# EAGLE design Arduino_UART_SIDEWAYS (EAGLE 7.4.0)
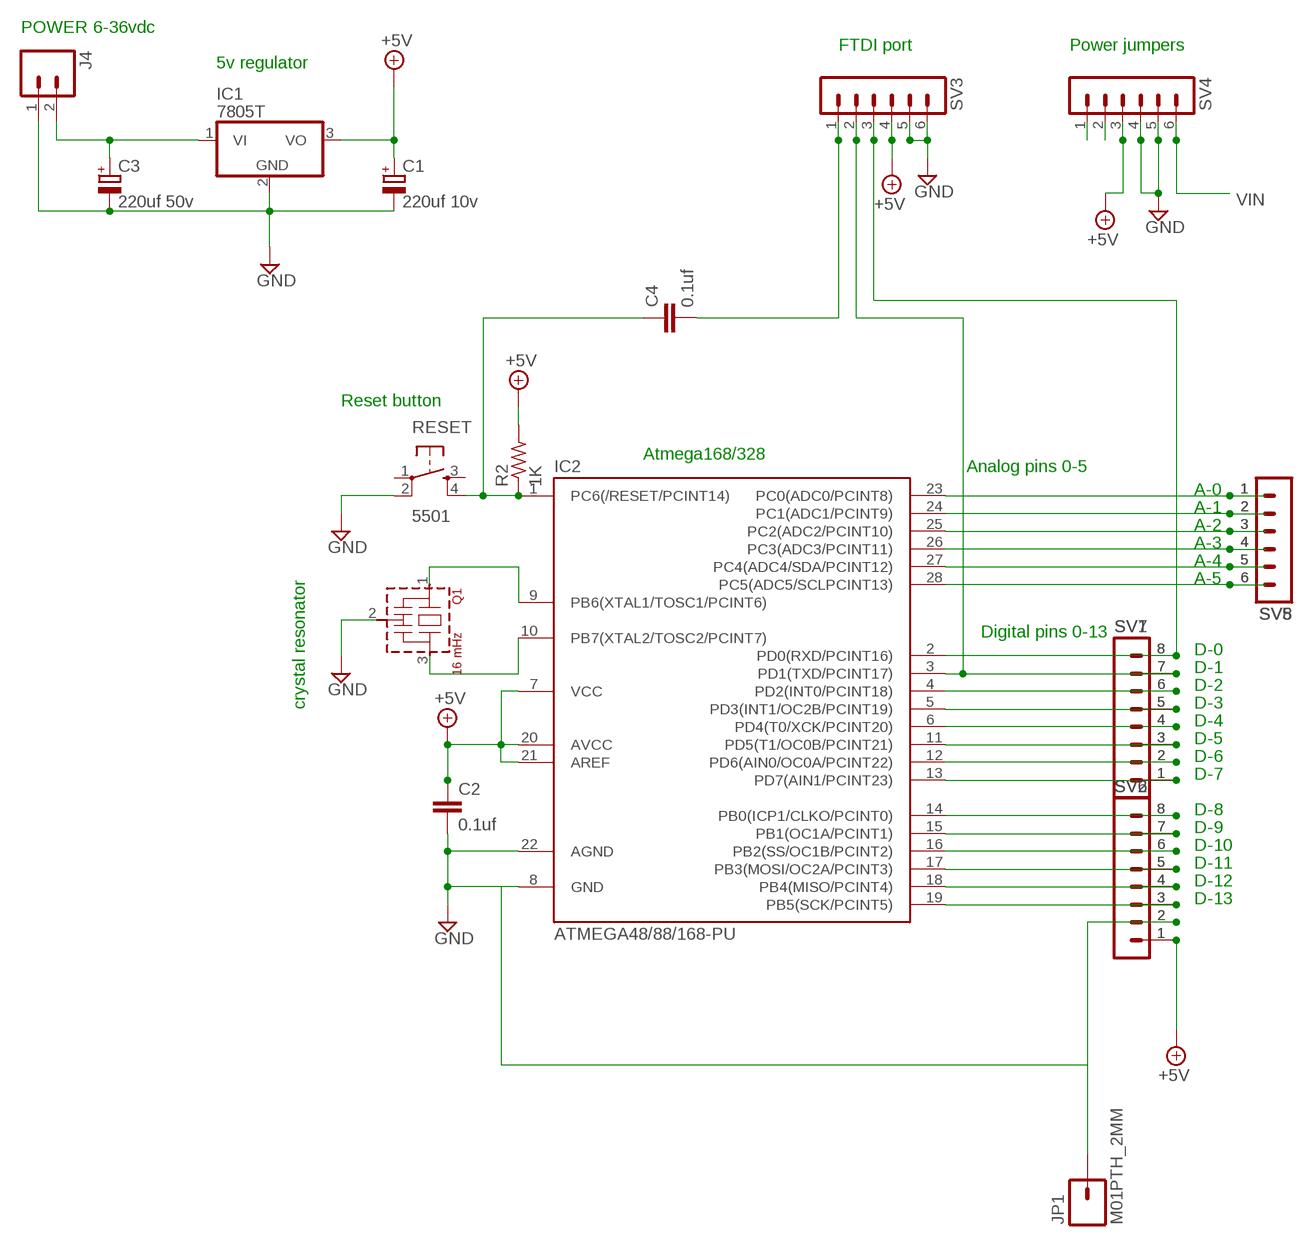
[diagram p0: schematic, sheet 1]

## Parts
C1  220uf 10v  CPOL-EUE2.5-6  [E2,5-6]
C2  0.1uf  C-EU050-024X044  [C050-024X044]
C3  220uf 50v  CPOL-EUE2.5-6  [E2,5-6]
C4  0.1uf  C-EU075-032X103  [C075-032X103]
IC1  7805T  [TO220H]
IC2  ATMEGA48/88/168-PU  [DIL28-3]
J4  M02LOCK  [1X02_LOCK]
JP1  M01PTH_2MM  [1X01_2MM]
Q1  16 mHz  CSTLS_X  [CSTLS_X]
R2  1K  R-US_0204/7  [0204/7]
RESET  5501  TAC_SWITCHPTH  [TACTILE-PTH]
SV1  MA08-1  [MA08-1]
SV2  MA08-1  [MA08-1]
SV3  MA06-1  [MA06-1]
SV4  MA06-1  [MA06-1]
SV5  MA06-1  [MA06-1]
SV6  MA08-1  [MA08-1]
SV7  MA08-1  [MA08-1]
SV8  MA06-1  [MA06-1]

## Nets
+5V: C1.+ C2.1 IC1.3(VO) IC2.7(VCC) IC2.20(AVCC) IC2.21(AREF) R2.2 SV2.1 SV3.4 SV4.3 SV6.1
A0: IC2.23(PC0(ADC0/PCINT8)) SV5.1 SV8.1
A1: IC2.24(PC1(ADC1/PCINT9)) SV5.2 SV8.2
A2: IC2.25(PC2(ADC2/PCINT10)) SV5.3 SV8.3
A3: IC2.26(PC3(ADC3/PCINT11)) SV5.4 SV8.4
A4: IC2.27(PC4(ADC4/SDA/PCINT12)) SV5.5 SV8.5
A5: IC2.28(PC5(ADC5/SCLPCINT13)) SV5.6 SV8.6
D0: IC2.2(PD0(RXD/PCINT16)) SV1.8 SV3.3 SV7.8
D1: IC2.3(PD1(TXD/PCINT17)) SV1.7 SV3.2 SV7.7
D2: IC2.4(PD2(INT0/PCINT18)) SV1.6 SV7.6
D3: IC2.5(PD3(INT1/OC2B/PCINT19)) SV1.5 SV7.5
D4: IC2.6(PD4(T0/XCK/PCINT20)) SV1.4 SV7.4
D5: IC2.11(PD5(T1/OC0B/PCINT21)) SV1.3 SV7.3
D6: IC2.12(PD6(AIN0/OC0A/PCINT22)) SV1.2 SV7.2
D7: IC2.13(PD7(AIN1/PCINT23)) SV1.1 SV7.1
D8: IC2.14(PB0(ICP1/CLKO/PCINT0)) SV2.8 SV6.8
D9: IC2.15(PB1(OC1A/PCINT1)) SV2.7 SV6.7
D10: IC2.16(PB2(SS/OC1B/PCINT2)) SV2.6 SV6.6
D11: IC2.17(PB3(MOSI/OC2A/PCINT3)) SV2.5 SV6.5
D12: IC2.18(PB4(MISO/PCINT4)) SV2.4 SV6.4
D13: IC2.19(PB5(SCK/PCINT5)) SV2.3 SV6.3
GND: C1.- C2.2 C3.- IC1.2(GND) IC2.8(GND) IC2.22(AGND) J4.1 JP1.1 Q1.2(VSS) RESET.2 SV2.2 SV3.5 SV3.6 SV4.4 SV4.5 SV6.2
N$1: C4.2 SV3.1
N$3: IC2.10(PB7(XTAL2/TOSC2/PCINT7)) Q1.3
N$5: IC2.9(PB6(XTAL1/TOSC1/PCINT6)) Q1.1
N$6: SV4.1
N$18: SV4.2
RESET: C4.1 IC2.1(PC6(/RESET/PCINT14)) R2.1 RESET.4
VIN: C3.+ IC1.1(VI) J4.2 SV4.6
Unconnected: RESET.1 RESET.3

## Notes on the sheet
- POWER 6-36vdc
- FTDI port | Power jumpers
- 5v regulator
- Reset button
- Atmega168/328 | Analog pins 0-5
- A-0
- A-1
- A-2
- A-3
- A-4
- A-5
- Digital pins 0-13
- D-0
- D-1
- D-2
- crystal resonator | D-3
- D-4
- D-5
- D-6
- D-7
- D-8
- D-9
- D-10
- D-11
- D-12
- D-13

## Library data of the parts
C1 C3 = rcl:CPOL-EU: POLARIZED CAPACITOR, European symbol
C2 C4 = rcl:C-EU: CAPACITOR, European symbol
IC1 = linear:78*: Positive VOLTAGE REGULATOR Source: http://cache.national.com/ds/LM/LM78L05.pdf http://www.fairchildsemi.com/ds/LM/LM7805.pdf
IC2 = atmega8:ATMEGA48/88/168-PU
J4 = SparkFun:M02: Header 2 Standard 2-pin 0.1" header. Use with straight break away headers (SKU : PRT-00116), right angle break away headers (PRT-00553), swiss pins (PRT-00743), machine pins (PRT-00117), and female headers (PRT-00115). Molex polarized connector foot print use with SKU : PRT-08233 with associated crimp pins and housings.
JP1 = SparkFun:M01: Header 1 Standard 1-pin 0.1" header. Use with straight break away headers (SKU : PRT-00116), right angle break away headers (PRT-00553), swiss pins (PRT-00743), machine pins (PRT-00117), and female headers (PRT-00115).
Q1 = murata-resonators:CSTLS_X: Ceramic resonator 16.00 to 70.00 MHz
R2 = rcl:R-US_: RESISTOR, American symbol
RESET = SparkFun:TAC_SWITCH: Momentary Switch Button commonly used for reset or general input. Spark Fun Electronics SKU : COM-00097
SV1 SV2 SV6 SV7 = con-lstb:MA08-1: PIN HEADER; OC_FARNELL: unknown; OC_NEWARK: unknown
SV3-SV5 SV8 = con-lstb:MA06-1: PIN HEADER; OC_FARNELL: unknown; OC_NEWARK: unknown

## Board
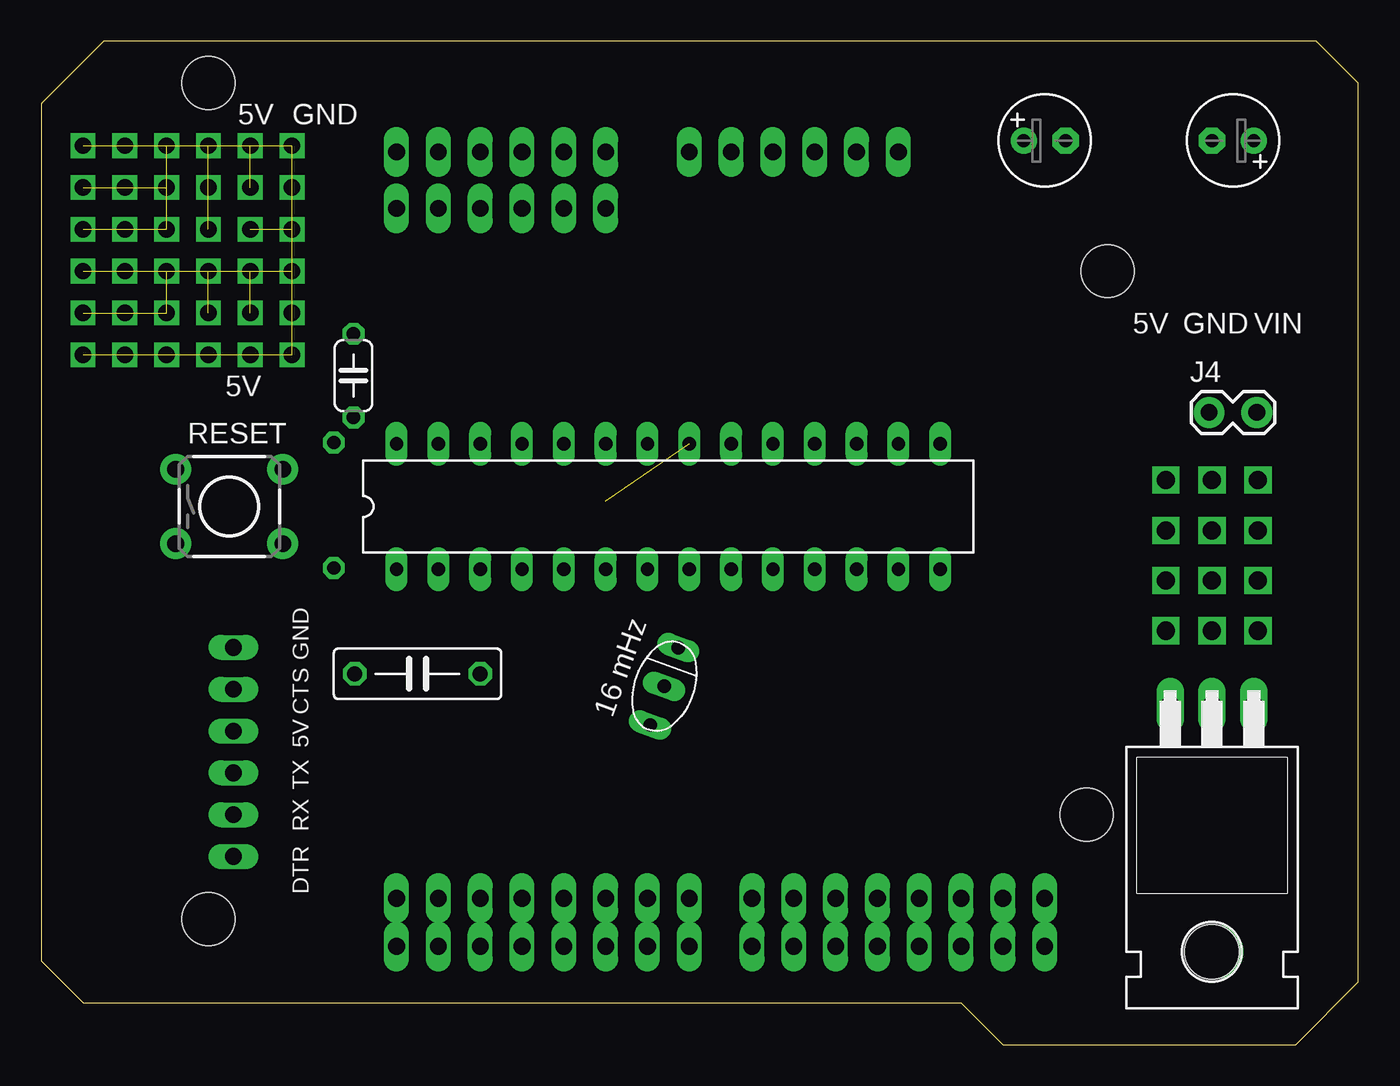
[diagram p1: board, top side]
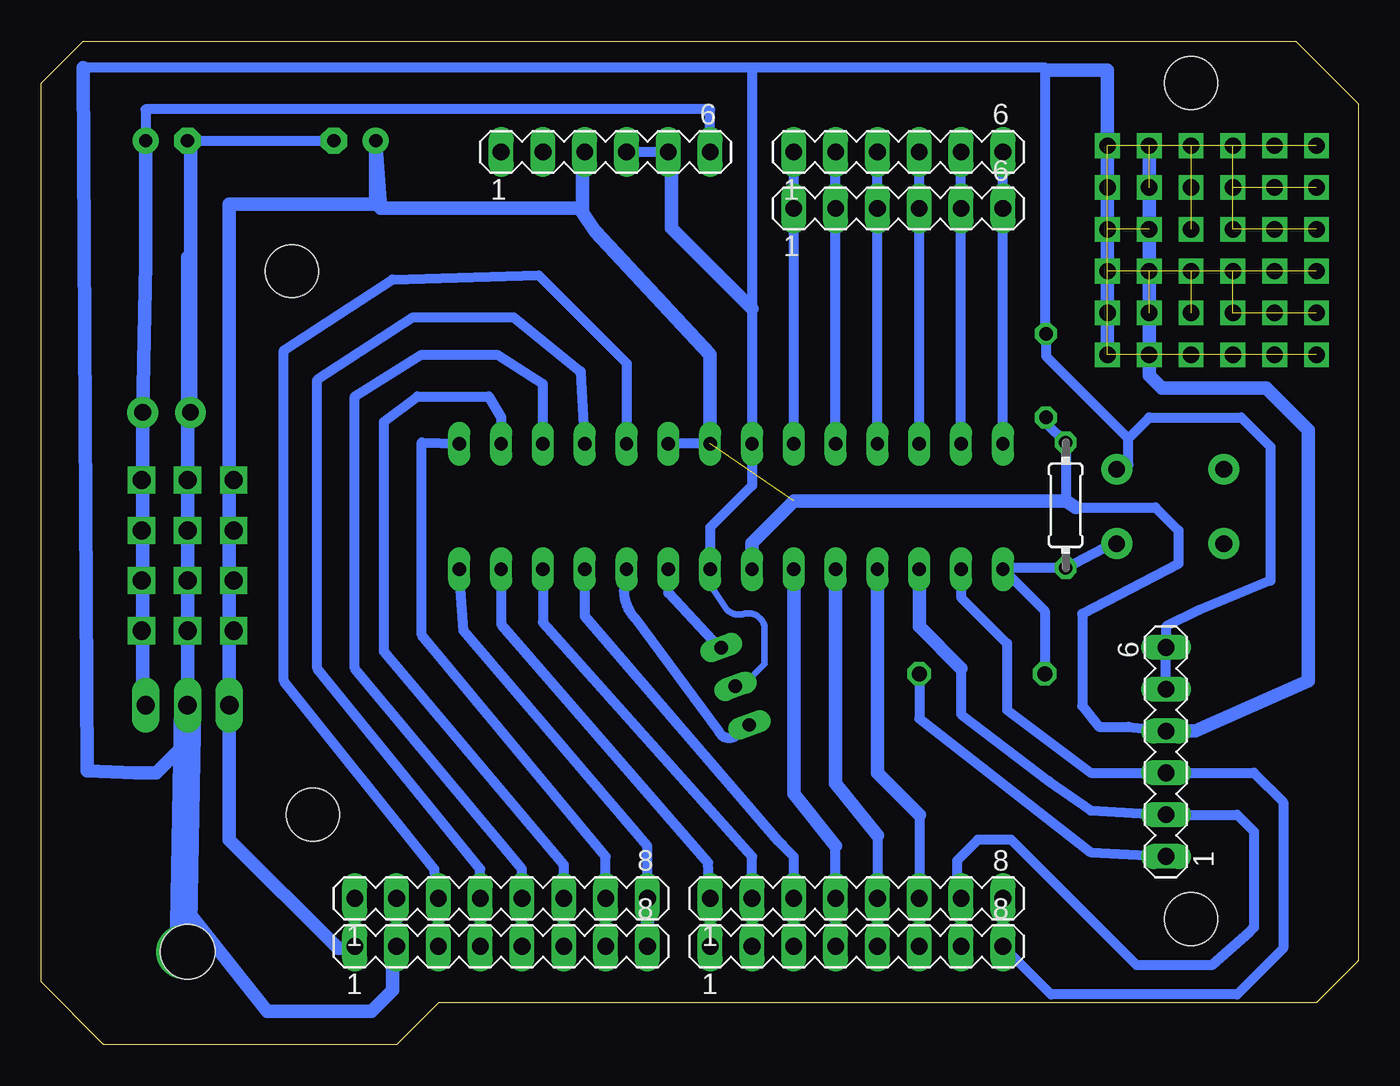
[diagram p2: board, bottom side, seen from below]

Size 80.01 x 60.96 mm. Coordinates in mm from the lower left corner, seen from the top.
Outline: 80.01,58.42 77.47,60.96 3.81,60.96 0,57.15 0,5.08 2.54,2.54 55.88,2.54 58.42,0 76.2,0 80.01,3.81 80.01,58.42
Copper layers (1*16): Top 0.035mm / dielectric 1.5mm / Bottom 0.035mm
Design rules "default *": minimum track width 10mil, minimum drill 24mil, track to track 30mil, track to pad 30mil, pad to pad 8mil, via to via 8mil, smd to smd 8mil, copper to edge 40mil, drill to drill 8mil, minimum pad ring 10mil, minimum via ring 8mil, stop-mask expansion 4mil, vias tented up to drill 0mil, thermal gap 10mil
Holes 3.2 mm at 10.16,58.42 63.5,13.97 64.77,46.99 10.16,7.62

### Footprints (pad centres in the part's own frame; a part is rotated, then mirrored left to right if it is on the bottom)
E2,5-6 = drill 0.813 pad 1.6: + -1.27,0 | drill 0.813 pad 1.6 octagon: - 1.27,0
C050-024X044 = drill 0.813 octagon: 1 -2.54,0; 2 2.54,0
C075-032X103 = drill 0.914 octagon: 1 -3.81,0; 2 3.81,0
TO220H = drill 1.118 long: 1 -2.54,-10.16; 2 0,-10.16; 3 2.54,-10.16 | hole 3.302: 0,4.826
DIL28-3 = drill 0.813 long: 1 -16.51,-3.81; 2 -13.97,-3.81; 3 -11.43,-3.81; 4 -8.89,-3.81; 5 -6.35,-3.81; 6 -3.81,-3.81; 7 -1.27,-3.81; 8 1.27,-3.81; 9 3.81,-3.81; 10 6.35,-3.81; 11 8.89,-3.81; 12 11.43,-3.81; 13 13.97,-3.81; 14 16.51,-3.81; 15 16.51,3.81; 16 13.97,3.81; 17 11.43,3.81; 18 8.89,3.81; 19 6.35,3.81; 20 3.81,3.81; 21 1.27,3.81; 22 -1.27,3.81; 23 -3.81,3.81; 24 -6.35,3.81; 25 -8.89,3.81; 26 -11.43,3.81; 27 -13.97,3.81; 28 -16.51,3.81
1X02_LOCK = drill 1.016 pad 1.88: 1 -0.178,0; 2 2.718,0
1X01_2MM = drill 2 pad 3.302: 1 0,0
CSTLS_X = drill 0.813 long: 1 -2.5,0; 2 0,0; 3 2.5,0
0204/7 = drill 0.813 octagon: 1 -3.81,0; 2 3.81,0
TACTILE-PTH = drill 1.016 pad 1.88: 1 -3.251,2.261; 2 3.251,2.261; 3 -3.251,-2.261; 4 3.251,-2.261
MA08-1 = drill 1.016 long: 1 -8.89,0; 2 -6.35,0; 3 -3.81,0; 4 -1.27,0; 5 1.27,0; 6 3.81,0; 7 6.35,0; 8 8.89,0
MA06-1 = drill 1.016 long: 1 -6.35,0; 2 -3.81,0; 3 -1.27,0; 4 1.27,0; 5 3.81,0; 6 6.35,0

### Placement (x,y rotation side)
C1  60.96,54.91 0 top
C2  18.97,40.64 90 top
C3  72.39,54.91 180 top
C4  22.86,22.53 0 top
IC1  71.12,10.46 180 top
IC2  38.1,32.69 0 top
J4  71.12,38.4 0 top
JP1  71.37,5.64 90 top
Q1  37.85,21.77 250 top
R2  17.78,32.77 90 bottom
RESET  11.43,32.69 0 top
SV1  30.48,5.97 0 bottom
SV2  52.07,5.97 0 bottom
SV3  11.68,17.78 90 bottom
SV4  45.72,54.23 0 bottom
SV5  27.94,54.23 0 bottom
SV6  52.07,8.89 0 bottom
SV7  30.48,8.89 0 bottom
SV8  27.94,50.8 0 bottom

### Tracks (layer width: path | path; a pad name or v marks a point on that pad's centre or on a via)
+5V  (1 unrouted)
  Bottom 0.61: IC2.21 IC2.20 | SV6.1 SV2.1 | 17.78,33.02 R2.2 18.97,37.77 C2.1 | 17.14,32.64 12.32,32.64 10.92,31.24 10.92,29.21 16.76,26.16 16.76,20.57 15.75,19.3 13.97,19.3 SV3.4
  Bottom 0.813: IC2.7 36.83,30.48 34.29,33.02 17.78,33.02 17.14,32.64 | IC2.21 39.37,41.91 46.35,49.4 47.12,50.55 47.12,50.67 | SV2.1 61.09,5.84 61.98,5.84 68.58,12.45 IC1.3 68.58,51.05 59.69,51.05 C1.+ 59.38,50.8 47.24,50.8 47.12,50.67 | 47.12,50.67 47.12,54.1 SV4.3
A0
  Bottom 0.61: IC2.23 SV8.1 SV5.1
A1
  Bottom 0.61: IC2.24 SV8.2 SV5.2
A2
  Bottom 0.61: IC2.25 SV8.3 SV5.3 | SV5.3 29.21,54.86 29.34,54.99 29.34,54.36 SV5.3
A3
  Bottom 0.61: IC2.26 SV8.4 SV5.4 26.67,54.74
A4
  Bottom 0.61: IC2.27 SV8.5 SV5.5
A5
  Bottom 0.61: IC2.28 SV8.6 SV5.6
D0
  Bottom 0.61: SV7.8 SV1.8 18.67,3.05 7.37,3.05 4.57,5.84 4.57,14.73 6.35,16.51 SV3.3 16.26,16.51 21.34,20.32 21.34,24.38 24.13,27.18 IC2.2
D1
  Bottom 0.61: SV1.7 SV7.7 24.38,9.14 24.38,11.18 23.11,12.45 21.08,12.45 13.46,4.83 8.89,4.83 6.6,6.86 6.35,7.11 6.35,12.95 7.37,13.97 SV3.2 16.26,14.22 18.8,16 24.13,20.07 24.13,22.86
  Bottom 0.813: IC2.3 26.67,25.4 24.13,22.86
D2
  Bottom 0.61: 26.67,13.97 SV7.6 SV1.6
  Bottom 0.813: IC2.4 29.21,16.51 26.67,13.97
D3
  Bottom 0.61: 29.21,12.7 SV7.5 SV1.5
  Bottom 0.813: IC2.5 31.75,15.88 29.21,12.7
D4
  Bottom 0.61: SV1.4 SV7.4 31.75,12.07
  Bottom 0.813: IC2.6 34.29,15.24 31.75,12.07
D5
  Bottom 0.61: IC2.11 46.99,26.04 35.24,12.36 | 35.24,12.36 34.92,12.07 | 35.24,12.36 34.29,11.41 SV7.3 SV1.3
D6
  Bottom 0.61: IC2.12 49.53,25.65 36.83,11.43 SV7.2 SV1.2
D7
  Bottom 0.61: IC2.13 52.07,25.53 39.5,11.05 SV7.1 SV1.1
D8
  Bottom 0.61: IC2.14 54.36,25.15 43.18,12.07 SV6.8
  Bottom 0.813: SV6.8 SV2.8
D9
  Bottom 0.61: 54.61,36.83 IC2.15 56.9,36.58 56.9,24.89 45.72,11.43 SV6.7 SV2.7
D10
  Bottom 0.61: SV2.6 SV6.6 48.26,10.92 59.18,23.88 59.18,37.85 57.15,39.37 52.83,39.37 52.07,38.1 IC2.16
D11
  Bottom 0.61: SV2.5 SV6.5 50.8,10.67 60.96,22.86 60.96,39.37 56.9,41.91 52.32,41.91 49.53,40.13 IC2.17
D12
  Bottom 0.61: SV2.4 SV6.4 53.34,10.67 63.25,22.86 63.25,40.39 57.4,44.2 51.31,44.2 47.24,40.89 IC2.18
D13
  Bottom 0.61: SV2.3 SV6.3 56.13,10.67 65.28,22.1 65.28,42.16 58.67,46.48 49.78,46.74 44.45,41.4 IC2.19
GND  (via drill 1.1)
  Bottom 0.406: 39.37,28.19 39.37,27.94 38.35,26.42 arc-62 37.34,26.16 arc111 36.07,25.15 36.07,23.11 37.41,21.77
  Bottom 0.61: RESET.2 13.97,35.23 13.97,36.83 | C1.- 70.61,54.91 C3.- 70.94,54.74 | 36.83,59.36 19.05,59.36 19.05,43.26 C2.2 18.97,41.83 13.97,36.83 | 36.83,59.36 36.83,44.7 IC2.22 36.83,33.96 39.37,31.42 IC2.8 39.37,28.19 | 36.83,59.36 77.47,59.36 | 41.73,54.05 SV4.5 SV4.4 | SV3.5 SV3.6 11.68,25.4 9.65,26.42 5.33,28.19 5.33,36.32 7.11,38.1 12.7,38.1 13.97,36.83 | Q1.2 37.41,21.77 | SV6.2 SV2.2
  Bottom 0.813: 70.94,48.01 J4.1 | 77.47,59.36 77.22,16.64 74.3,16.51 73.03,16.51 71.12,18.41 IC1.2 v71.12,25.15 v71.12,28.19 v71.12,31.24 v71.12,34.29 71.12,47.83 70.94,48.01 | 70.94,48.01 70.94,54.59 70.61,54.91 | 41.73,54.05 41.73,49.6 36.83,44.7 | JP1.1 71.17,8.18 66.29,2.03 59.94,2.03 58.67,3.3 58.67,6.35 58.42,6.6 SV2.2
  Bottom 1.676: JP1.1 IC1.2
N$1
  Bottom 0.61: C4.2 26.67,19.81 16.26,11.68 SV3.1
N$2  (via drill 1)  (35 unrouted)
  other vias: 15.24,54.61 12.7,54.61 10.16,54.61 7.62,54.61 15.24,52.07 15.24,49.53 15.24,46.99 12.7,52.07 10.16,52.07 7.62,52.07 12.7,49.53 12.7,46.99 10.16,49.53 10.16,46.99 7.62,49.53 7.62,46.99 15.24,44.45 15.24,41.91 12.7,44.45 12.7,41.91 10.16,44.45 10.16,41.91 7.62,44.45 7.62,41.91 5.08,54.61 5.08,52.07 5.08,49.53 5.08,46.99 5.08,44.45 5.08,41.91 2.54,41.91 2.54,44.45 2.54,46.99 2.54,49.53 2.54,52.07 2.54,54.61
N$3
  Bottom 0.61: IC2.10 44.45,28.45 arc-64 43.94,25.91 38.86,19.05 arc-135 37.59,19.05 37.59,19.42 Q1.3
N$4  (via drill 1.1)
  other vias: 68.33,25.15
N$5
  Bottom 0.61: Q1.1 38.85,24.12 41.91,27.43 IC2.9
N$7  (via drill 1.1)
  other vias: 68.33,28.19
N$8  (via drill 1.1)
  other vias: 68.33,31.24
N$9  (via drill 1.1)
  other vias: 68.33,34.29
N$10  (via drill 1.1)
  other vias: 73.91,25.15
N$11  (via drill 1.1)
  other vias: 73.91,28.19
N$12  (via drill 1.1)
  other vias: 73.91,31.24
N$13  (via drill 1.1)
  other vias: 73.91,34.29
N$16
  Bottom 0.813: 18.8,59.18 15.24,59.18 15.24,41.66
N$17
  Bottom 0.813: 11.94,19.05 9.91,19.05 3.05,22.1 3.05,37.34 5.59,39.88 11.94,39.88 12.7,40.64 12.7,54.86
RESET
  Bottom 0.61: C4.1 19.05,26.34 IC2.1 21.51,28.96 R2.1 14.88,30.48 RESET.4 15.24,30.15
VIN
  Bottom 0.61: C3.+ 73.66,56.82 39.37,56.82 SV4.6
  Bottom 0.813: C3.+ 73.66,47.47 J4.2 73.84,20.8 IC1.1

### Text on the board
tNames: 5V | GND | 5V | GND | VIN | 5V | GND | CTS | 5V | TX | RX | DTR